# Altium schematic sheet 28Pins_Schematic.SchDoc (part 3 of 3)
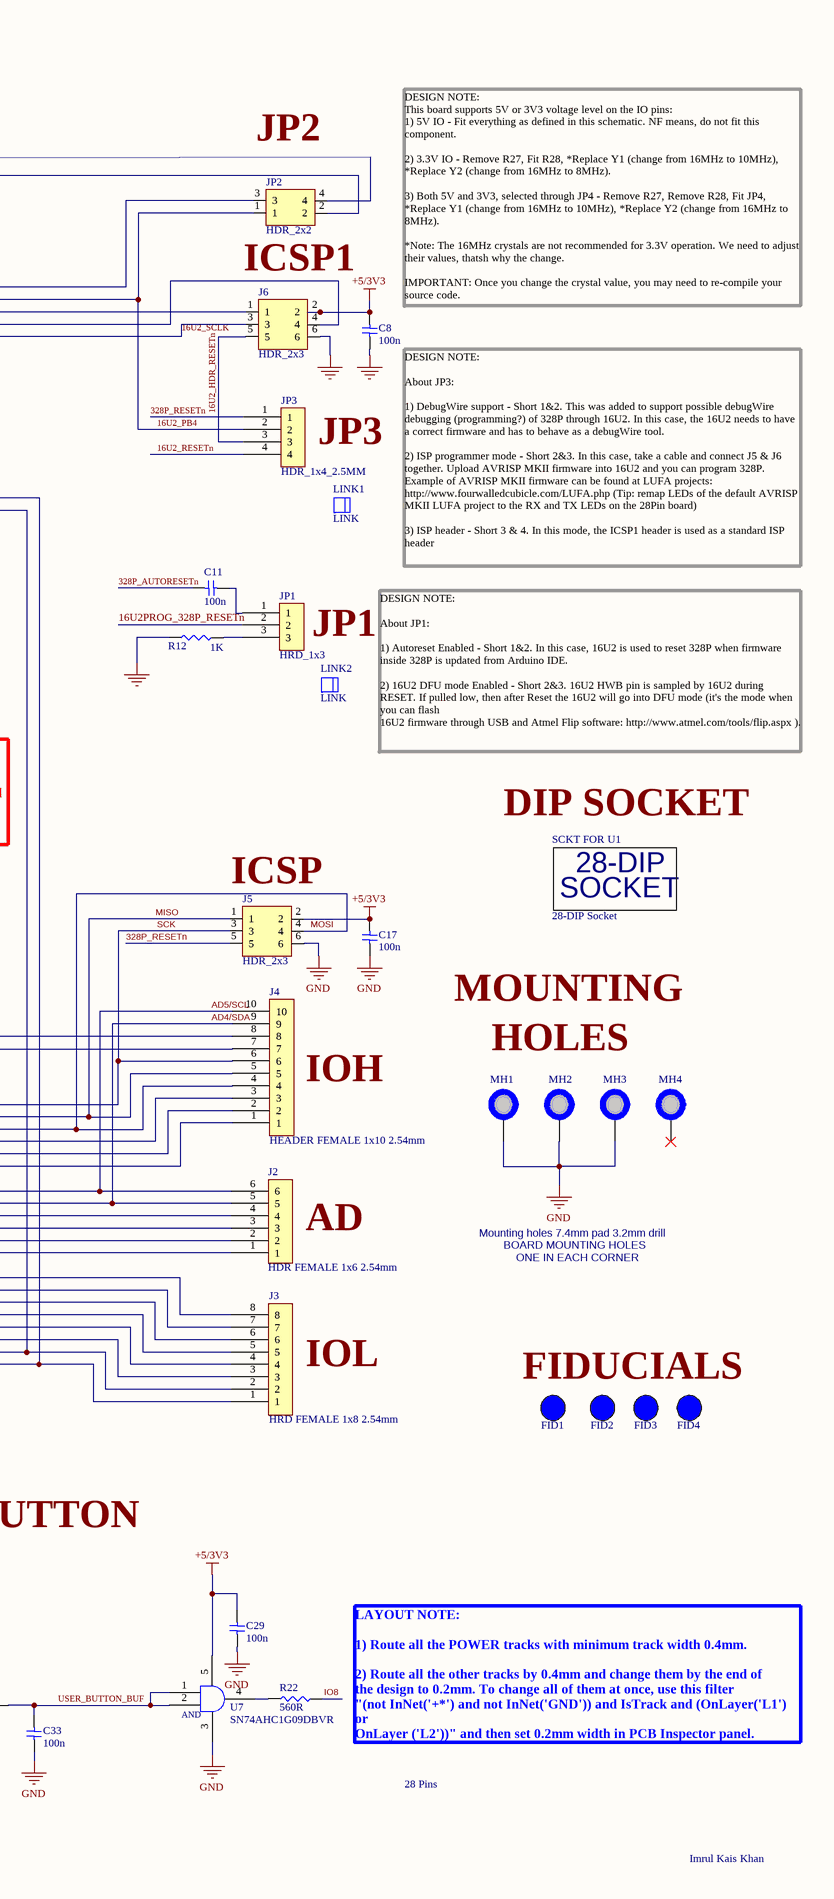
[diagram p3: 28Pins_Schematic.SchDoc, right]

## Library data of the parts (continued)
SCKT_FOR_U1 = 4828-3004-CP: Socket DIP 28Cnts DualWipe 0.3InSpc. PhosphorBronze Nickel KinkedTail 4800Series; Manufacturer: 3M; Number of Contacts: 28; Gender: Female; Insulation Resistance: 5GR; Current Rating: 1A; Pitch: 2.54mm; Row Spacing: 7.62mm; Supplier 1: Digi-Key; Manufacturer Part Number: 4828-3004-CP; RoHS: Yes; Category: Connectors; Stock 1: 15331; Pricing 1: 1=1.06000, 10=0.89600, 25=0.85880, 50=0.84060, 100=0.80410, 250=0.73104, 500=0.65794, 1000=0.58483, 2500=0.53000 (USD); Mount: Through Hole; Contact Plating: Tin; Contact Material: Bronze; Housing Material: Glass; Insulation Material: Polyester; Contact Finish - Mating: TIN; Min Operating Temperature: -25°C; Max Operating Temperature: 85°C; Number of Rows: 2; Termination: Solder; Orientation: Straight; Packaging: Rail/Tube; Package Quantity: 5600; Number of Positions: 28; Connector Type: DIP; Series: 4800; Length: 35.43mm; Width: 10.16mm; Depth: 10.16mm; Lead Free: Lead Free; RoHS Compliant: Yes; Flammability Rating: UL94 V-0; ComponentLink1URL: https://datasheet.ciiva.com/768/ts1099-768354.pdf?src-supplier=Digi-Key; ComponentLink1Description: https://datasheet.ciiva.com/768/ts1099-768354.pdf?src-supplier=Digi-Key; Supplier Part Number 1: 3M5480-ND
SW1 SW2 = 1825910-6: Switch Tactile OFF (ON) SPST Round Button PC Pins 0.05A 24VDC 1.57N Thru-Hole Loose; Manufacturer: TE Connectivity Alcoswitch; Mechanical Life: 100000Cycles; Actuator Material: PBT; Actuator Color: Black; Operating Force: 160gf; Illumination Type: Non-Illuminated,Illuminated; Max Voltage Rating (DC): 24V; Contact Resistance: 100mR; Contact Current Rating: 50mA; Switch Travel: 0.25mm; Switch Function: Off-Mom; Actuator Type: Standard; Actuator Length: 0.055inch; Supplier 1: Digi-Key; Manufacturer Part Number: 1825910-6; RoHS: Yes; Category: Pushbutton Switches; Stock 1: 82427; Pricing 1: 1=0.13000, 10=0.12500, 25=0.11840, 100=0.10780, 250=0.10132, 500=0.09268, 1000=0.07759, 2500=0.07544, 5000=0.07113 (USD); Mount: Through Hole; Contact Material: Copper Alloy; Contact Plating: Silver; Min Operating Temperature: -35°C; Max Operating Temperature: 85°C; Package Quantity: 750; Termination: PC Pins; Throw Configuration: SPST; Electrical Life: 100000Cycles; Orientation: Straight; Series: FSMJ; Packaging: Loose Piece; Type: Switch; Max Current Rating: 50mA; Length: 5.99mm; RoHS Compliant: Yes; ELV: Compliant; Lead Free: Lead Free; ComponentLink1URL: https://datasheet.ciiva.com/30199/1825910-6rqpn1825910-6-30199520.pdf?src-supplier=Onlinecomponents.com; ComponentLink1Description: https://datasheet.ciiva.com/30199/1825910-6rqpn1825910-6-30199520.pdf?src-supplier=Onlinecomponents.com; ComponentLink2URL: https://datasheet.ciiva.com/15184/getdatasheetpartid-395915-15184509.pdf?src-supplier=Verical; ComponentLink2Description: https://datasheet.ciiva.com/15184/getdatasheetpartid-395915-15184509.pdf?src-supplier=Verical; Supplier Part Number 1: 450-1650-ND
U1 = ATMEGA328P-PU: ATMEGA328P-PU; 8 bit Microcontroller AVR 20MHz 1; 32kb Flash; 2kb RAM; I2C SPI 2; Manufacturer: Microchip / Atmel; Number of PWM Channels: 6; Number of Timers/Counters: 3; Min Supply Voltage: 1.8V; Max Supply Voltage: 5.5V; Interface: I2C,SPI,UART,USART,2-Wire; Number of I/Os: 23; Oscillator Type: Internal; Data Bus Width: 8b; Number of SPI Channels: 1; Watchdog Timer: Yes; Peripherals: Brown-out Detect/Reset,POR,PWM,WDT; Supplier 1: Digi-Key; Manufacturer Part Number: ATMEGA328P-PU; RoHS: Yes; Category: Microcontrollers; Stock 1: 4980; Pricing 1: 1=2.08000, 25=1.91000, 100=1.73000 (USD); Mount: Through Hole; Case/Package: PDIP; Number of Pins: 28; Contact Plating: Tin,Matte; Min Operating Temperature: -40°C; Max Operating Temperature: 85°C; Core Architecture: AVR; Package Quantity: 14; RAM Size: 2KB; Number of ADC Channels: 6; Packaging: Rail/Tube; Frequency: 20MHz; Number of Programmable I/O: 23; Max Frequency: 20MHz; Number of I2C Channels: 1; Memory Type: FLASH; Memory Size: 32KB; Length: 37.4mm; Height: 3.28mm; Width: 6.76mm; Radiation Hardening: No; REACH SVHC: No SVHC; Lead Free: Lead Free; ComponentLink1URL: https://datasheet.ciiva.com/1157/1684409-1157696.pdf?src-supplier=Element14; ComponentLink1Description: https://datasheet.ciiva.com/1157/1684409-1157696.pdf?src-supplier=Element14; ComponentLink2URL: https://datasheet.ciiva.com/20168/73-4283-20168380.pdf?src-supplier=Rapid+Electronics; ComponentLink2Description: https://datasheet.ciiva.com/20168/73-4283-20168380.pdf?src-supplier=Rapid+Electronics; ComponentLink3URL: https://datasheet.ciiva.com/19457/2139111-19457070.pdf?src-supplier=Jameco; ComponentLink3Description: https://datasheet.ciiva.com/19457/2139111-19457070.pdf?src-supplier=Jameco; ComponentLink4URL: https://datasheet.ciiva.com/29119/155197-da-01-en-microcontr-atmega328p-pu-8bit-pdip-28-29119593.pdf?src-supplier=Conrad; ComponentLink4Description: https://datasheet.ciiva.com/29119/155197-da-01-en-microcontr-atmega328p-pu-8bit-pdip-28-29119593.pdf?src-supplier=Conrad; ComponentLink5URL: https://datasheet.ciiva.com/26818/atmega328p-pu-26818578.pdf?src-supplier=IIIC; ComponentLink5Description: https://datasheet.ciiva.com/26818/atmega328p-pu-26818578.pdf?src-supplier=IIIC; ComponentLink6URL: https://datasheet.ciiva.com/15213/getdatasheetpartid-318533-15213133.pdf?src-supplier=Verical; ComponentLink6Description: https://datasheet.ciiva.com/15213/getdatasheetpartid-318533-15213133.pdf?src-supplier=Verical; Supplier Part Number 1: ATMEGA328P-PU-ND
U2 = ATMEGA16U2-AU: ATmega Series 16 KB Flash 512 B RAM 16 MHz 8-Bit Microcontroller - TQFP-32; Manufacturer: Microchip; Core Architecture: AVR; Interface: SPI,USB,UART,USART; Frequency: 16MHz; Memory Size: 16KB; Peripherals: Brown-out Detect/Reset,POR,PWM,WDT; Number of I/Os: 22; Oscillator Type: Internal; Supplier 1: Digi-Key; Manufacturer Part Number: ATMEGA16U2-AU; RoHS: No; Category: Microcontrollers; Stock 1: 3559; Pricing 1: 1=2.45000, 25=2.25000, 100=2.04000 (USD); Case/Package: TQFP; Number of Pins: 32; Min Operating Temperature: -40°C; Max Operating Temperature: 85°C; Memory Type: FLASH; Packaging: Tray; ComponentLink1URL: http://www.farnell.com/datasheets/1795896.pdf?src-supplier=Farnell; ComponentLink1Description: http://www.farnell.com/datasheets/1795896.pdf?src-supplier=Farnell; ComponentLink2URL: http://www.microchip.com/mymicrochip/filehandler.aspx?ddocname=en590463&src-supplier=Verical; ComponentLink2Description: http://www.microchip.com/mymicrochip/filehandler.aspx?ddocname=en590463&src-supplier=Verical; ComponentLink3URL: http://www.microchip.com/mymicrochip/filehandler.aspx?ddocname=en590463&src-supplier=Digi-Key; ComponentLink3Description: http://www.microchip.com/mymicrochip/filehandler.aspx?ddocname=en590463&src-supplier=Digi-Key; ComponentLink4URL: http://www.microchip.com/mymicrochip/filehandler.aspx?ddocname=en590463&src-supplier=Avnet; ComponentLink4Description: http://www.microchip.com/mymicrochip/filehandler.aspx?ddocname=en590463&src-supplier=Avnet; ComponentLink5URL: http://www.farnell.com/datasheets/1795896.pdf?src-supplier=Element14; ComponentLink5Description: http://www.farnell.com/datasheets/1795896.pdf?src-supplier=Element14; ComponentLink6URL: http://www.microchip.com/mymicrochip/filehandler.aspx?ddocname=en590463&src-supplier=Onlinecomponents.com; ComponentLink6Description: http://www.microchip.com/mymicrochip/filehandler.aspx?ddocname=en590463&src-supplier=Onlinecomponents.com; ComponentLink7URL: http://www.microchip.com/mymicrochip/filehandler.aspx?ddocname=en590463&src-supplier=RSComponents; ComponentLink7Description: http://www.microchip.com/mymicrochip/filehandler.aspx?ddocname=en590463&src-supplier=RSComponents; ComponentLink8URL: http://www.microchip.com/mymicrochip/filehandler.aspx?ddocname=en590463&src-supplier=Avnet+Europe; ComponentLink8Description: http://www.microchip.com/mymicrochip/filehandler.aspx?ddocname=en590463&src-supplier=Avnet+Europe; ComponentLink9URL: http://www.microchip.com/mymicrochip/filehandler.aspx?ddocname=en590463&src-supplier=Mouser; ComponentLink9Description: http://www.microchip.com/mymicrochip/filehandler.aspx?ddocname=en590463&src-supplier=Mouser; ComponentLink10URL: http://www.microchip.com/mymicrochip/filehandler.aspx?ddocname=en590463&src-supplier=Avnet+Asia; ComponentLink10Description: http://www.microchip.com/mymicrochip/filehandler.aspx?ddocname=en590463&src-supplier=Avnet+Asia; ComponentLink11URL: http://www.microchip.com/mymicrochip/filehandler.aspx?ddocname=en590463&src-supplier=Arrow+Electronics; ComponentLink11Description: http://www.microchip.com/mymicrochip/filehandler.aspx?ddocname=en590463&src-supplier=Arrow+Electronics; ComponentLink12URL: http://www.microchip.com/mymicrochip/filehandler.aspx?ddocname=en590463&src-supplier=microchipDIRECT; ComponentLink12Description: http://www.microchip.com/mymicrochip/filehandler.aspx?ddocname=en590463&src-supplier=microchipDIRECT; ComponentLink13URL: http://www.microchip.com/mymicrochip/filehandler.aspx?ddocname=en590463&src-supplier=Electro+Sonic; ComponentLink13Description: http://www.microchip.com/mymicrochip/filehandler.aspx?ddocname=en590463&src-supplier=Electro+Sonic; ComponentLink14URL: http://www.microchip.com/mymicrochip/filehandler.aspx?ddocname=en590463&src-supplier=TME; ComponentLink14Description: http://www.microchip.com/mymicrochip/filehandler.aspx?ddocname=en590463&src-supplier=TME; Supplier Part Number 1: ATMEGA16U2-AU-ND
U3 = TL1963A-33DCQR: LDO Regulator Pos 3.3V 1.5A 6-Pin(5+Tab) SOT-223 T/R; Manufacturer: Texas Instruments; Dropout Voltage: 340mV; Number of Outputs: 1; Max Input Voltage: 20V; Min Input Voltage: 2.1V; Min Current Limit: 1.6A; Input Bias Current: 1mA; Polarity: Positive; Accuracy: 3%; Output Type: Fixed; Supplier 1: Texas Instruments; Manufacturer Part Number: TL1963A-33DCQR; RoHS: Yes; Category: Voltage Regulators - Linear; Stock 1: 5786; Pricing 1: 1=2.60400, 100=2.28200, 250=1.60000, 1000=1.28900 (USD); Case/Package: SOT-223; Number of Pins: 6; Contact Plating: Gold; Min Operating Temperature: -40°C; Max Operating Temperature: 125°C; Package Quantity: 1; Packaging: Tape and Reel; Output Voltage: 3.3V; Output Current: 1.5A; Max Output Current: 1.5A; Number of Regulators: 1; Quiescent Current: 1mA; Max Output Voltage: 3.3V; Min Output Voltage: 3.3V; Series: -; Radiation Hardening: No; Lead Free: Lead Free; RoHS Compliant: Yes; ComponentLink1URL: https://datasheet.ciiva.com/2046/tl1963a-2046162.pdf?src-supplier=Digi-Key; ComponentLink1Description: https://datasheet.ciiva.com/2046/tl1963a-2046162.pdf?src-supplier=Digi-Key; ComponentLink2URL: https://datasheet.ciiva.com/2046/tl1963a-2046161.pdf?src-supplier=Digi-Key; ComponentLink2Description: https://datasheet.ciiva.com/2046/tl1963a-2046161.pdf?src-supplier=Digi-Key; ComponentLink3URL: https://datasheet.ciiva.com/2046/tl1963a-2046163.pdf?src-supplier=Digi-Key; ComponentLink3Description: https://datasheet.ciiva.com/2046/tl1963a-2046163.pdf?src-supplier=Digi-Key; Supplier Part Number 1: TL1963A-33DCQR
U4-U7 = SN74AHC1G09DBVR: Single 2-input, 2-V to 5.5-V AND gate with open-drain outputs 5-SOT-23 -55 to 125; Manufacturer: Texas Instruments; Min Supply Voltage: 2V; Max Supply Voltage: 5.5V; Quiescent Current: 1uA; Number of Inputs: 2; Propagation Delay: 7.5ns; Output Current: 25mA; Number of Circuits: 1; Low Level Output Current: 8mA; Supplier 1: Digi-Key; Manufacturer Part Number: SN74AHC1G09DBVR; RoHS: Yes; Category: Logic Gates; Stock 1: 5; Pricing 1: 1=0.41000, 10=0.30500, 25=0.26720, 100=0.17290, 250=0.14312, 500=0.11448, 1000=0.08777 (USD); Mount: Surface Mount; Case/Package: SOT-23; Number of Pins: 5; Contact Plating: Tin,Matte; Min Operating Temperature: -55°C; Max Operating Temperature: 125°C; Logic Function: AND GATE; Package Quantity: 3000; Packaging: Tape and Reel; Number of Gates: 1; Number of Elements: 1; Number of Bits: 1; Series: 74AHC; Technology: CMOS; Output Voltage: 5.5V; Number of Outputs: 1; Radiation Hardening: No; Reach SVHC Compliant: Yes; Lead Free: Lead Free; RoHS Compliant: Yes; ComponentLink1URL: https://datasheet.ciiva.com/1864/sn74ahc1g09-1864411.pdf?src-supplier=Digi-Key; ComponentLink1Description: https://datasheet.ciiva.com/1864/sn74ahc1g09-1864411.pdf?src-supplier=Digi-Key; ComponentLink2URL: https://datasheet.ciiva.com/1864/sn74ahc1g09-1864410.pdf?src-supplier=Digi-Key; ComponentLink2Description: https://datasheet.ciiva.com/1864/sn74ahc1g09-1864410.pdf?src-supplier=Digi-Key; ComponentLink3URL: https://datasheet.ciiva.com/1864/sn74ahc1g09-1864412.pdf?src-supplier=Digi-Key; ComponentLink3Description: https://datasheet.ciiva.com/1864/sn74ahc1g09-1864412.pdf?src-supplier=Digi-Key; Supplier Part Number 1: 296-29202-1-ND
Y1 Y2 = ABM7-16.000MHZ-D2Y-T: Crystal 16MHz ±20ppm (Tol) ±30ppm (Stability) 18pF FUND 50Ohm 2-Pin Mini-CSMD T/R; Manufacturer: Abracon; ESR (Equivalent Series Resistance): 50R; Supplier 1: Digi-Key; Manufacturer Part Number: ABM7-16.000MHZ-D2Y-T; RoHS: Yes; Category: Crystals; Stock 1: 130152; Pricing 1: 1=0.67000, 10=0.55600, 50=0.50000, 100=0.44440, 500=0.42218 (USD); Mount: Surface Mount; Case/Package: CSMD; Number of Pins: 2; Min Operating Temperature: -40°C; Max Operating Temperature: 85°C; Frequency Tolerance: 20ppm; Load Capacitance: 18pF; Frequency: 16MHz; Frequency Stability: 30ppm; Packaging: Tape and Reel; Package Quantity: 1000; Tolerance: 20ppm; Termination: SMD/SMT; Resistor Type: Ceramic; Series: ABM7; Operating Frequency: 16 MHz; Length: 6mm; Width: 3.3mm; Height: 1.4mm; Depth: 3.5mm; Radiation Hardening: No; Lead Free: Lead Free; ComponentLink1URL: https://datasheet.ciiva.com/15116/getdatasheetpartid-721624-15116835.pdf?src-supplier=Verical; ComponentLink1Description: https://datasheet.ciiva.com/15116/getdatasheetpartid-721624-15116835.pdf?src-supplier=Verical; ComponentLink2URL: https://datasheet.ciiva.com/5788/abm7-5788054.pdf?src-supplier=Farnell; ComponentLink2Description: https://datasheet.ciiva.com/5788/abm7-5788054.pdf?src-supplier=Farnell; ComponentLink3URL: https://datasheet.ciiva.com/7998/947971-7998600.pdf?src-supplier=Element14; ComponentLink3Description: https://datasheet.ciiva.com/7998/947971-7998600.pdf?src-supplier=Element14; ComponentLink4URL: https://datasheet.ciiva.com/22658/947971-22658293.pdf?src-supplier=Element14; ComponentLink4Description: https://datasheet.ciiva.com/22658/947971-22658293.pdf?src-supplier=Element14; ComponentLink5URL: https://datasheet.ciiva.com/46385/947971-46385243.pdf?src-supplier=Element14; ComponentLink5Description: https://datasheet.ciiva.com/46385/947971-46385243.pdf?src-supplier=Element14; ComponentLink6URL: https://datasheet.ciiva.com/18649/abm7-18649866.pdf?src-supplier=Digi-Key; ComponentLink6Description: https://datasheet.ciiva.com/18649/abm7-18649866.pdf?src-supplier=Digi-Key; ComponentLink7URL: https://datasheet.ciiva.com/18649/abm7-18649865.pdf?src-supplier=Digi-Key; ComponentLink7Description: https://datasheet.ciiva.com/18649/abm7-18649865.pdf?src-supplier=Digi-Key; ComponentLink8URL: https://datasheet.ciiva.com/18649/abm7-18649867.pdf?src-supplier=Digi-Key; ComponentLink8Description: https://datasheet.ciiva.com/18649/abm7-18649867.pdf?src-supplier=Digi-Key; ComponentLink9URL: https://datasheet.ciiva.com/16383/abm7-16383174.pdf?src-supplier=Future+Electronics; ComponentLink9Description: https://datasheet.ciiva.com/16383/abm7-16383174.pdf?src-supplier=Future+Electronics; ComponentLink10URL: https://datasheet.ciiva.com/26941/getdatasheetpartid-719818-26941724.pdf?src-supplier=Verical; ComponentLink10Description: https://datasheet.ciiva.com/26941/getdatasheetpartid-719818-26941724.pdf?src-supplier=Verical; Supplier Part Number 1: 535-9840-1-ND
Z1 Z2 = CG0603MLC-05E: ESD Suppressor Multilayer Varistor 5V Automotive 2-Pin Case 0603(1608Metric) T/R; Manufacturer: Bourns; Capacitance: 0.5pF; Voltage Rating (AC): 8V; Number of Channels: 1; Clamping Voltage: 20V; Current Rating: 50nA; Turn-On Delay Time: 1ns; Element Configuration: Single; Supplier 1: Digi-Key; Manufacturer Part Number: CG0603MLC-05E; RoHS: Yes; Category: Varistors; Stock 1: 453047; Pricing 1: 1=0.45000, 10=0.33600, 25=0.30320, 100=0.20960, 250=0.17648, 500=0.14338, 1000=0.11029, 2500=0.09926 (USD); Case/Package: 0603; Number of Pins: 2; Case Code (Imperial): 0603; Case Code (Metric): 1608; Contact Plating: Tin; Min Operating Temperature: -40°C; Max Operating Temperature: 85°C; Voltage Rating (DC): 5V; Operating Supply Voltage: 5V; Package Quantity: 1; Packaging: Tape and Reel; Termination: SMD/SMT; Voltage: 5V; Number of Circuits: 1; Max Voltage Rating (DC): 5V; Working Voltage: 5V; Leakage Current: 50nA; Series: MLC; Length: 1.6mm; Width: 0.8mm; Depth: 0.8mm; Thickness: 0.8mm; Radiation Hardening: No; Reach SVHC Compliant: Yes; RoHS Compliant: Yes; ComponentLink1URL: https://datasheet.ciiva.com/27747/1163231-27747629.pdf?src-supplier=Jameco; ComponentLink1Description: https://datasheet.ciiva.com/27747/1163231-27747629.pdf?src-supplier=Jameco; ComponentLink2URL: https://datasheet.ciiva.com/30070/mlc-30070503.pdf?src-supplier=Onlinecomponents.com; ComponentLink2Description: https://datasheet.ciiva.com/30070/mlc-30070503.pdf?src-supplier=Onlinecomponents.com; ComponentLink3URL: https://datasheet.ciiva.com/6991/mlc-6991832.pdf?src-supplier=Digi-Key; ComponentLink3Description: https://datasheet.ciiva.com/6991/mlc-6991832.pdf?src-supplier=Digi-Key; ComponentLink4URL: https://datasheet.ciiva.com/6991/mlc-6991834.pdf?src-supplier=Digi-Key; ComponentLink4Description: https://datasheet.ciiva.com/6991/mlc-6991834.pdf?src-supplier=Digi-Key; ComponentLink5URL: https://datasheet.ciiva.com/6991/mlc-6991836.pdf?src-supplier=Digi-Key; ComponentLink5Description: https://datasheet.ciiva.com/6991/mlc-6991836.pdf?src-supplier=Digi-Key; ComponentLink6URL: https://datasheet.ciiva.com/1278/1785244-1278701.pdf?src-supplier=Element14; ComponentLink6Description: https://datasheet.ciiva.com/1278/1785244-1278701.pdf?src-supplier=Element14; Supplier Part Number 1: CG0603MLC-05ECT-ND